# Altium project battery_expansion_breakout.PrjPcb
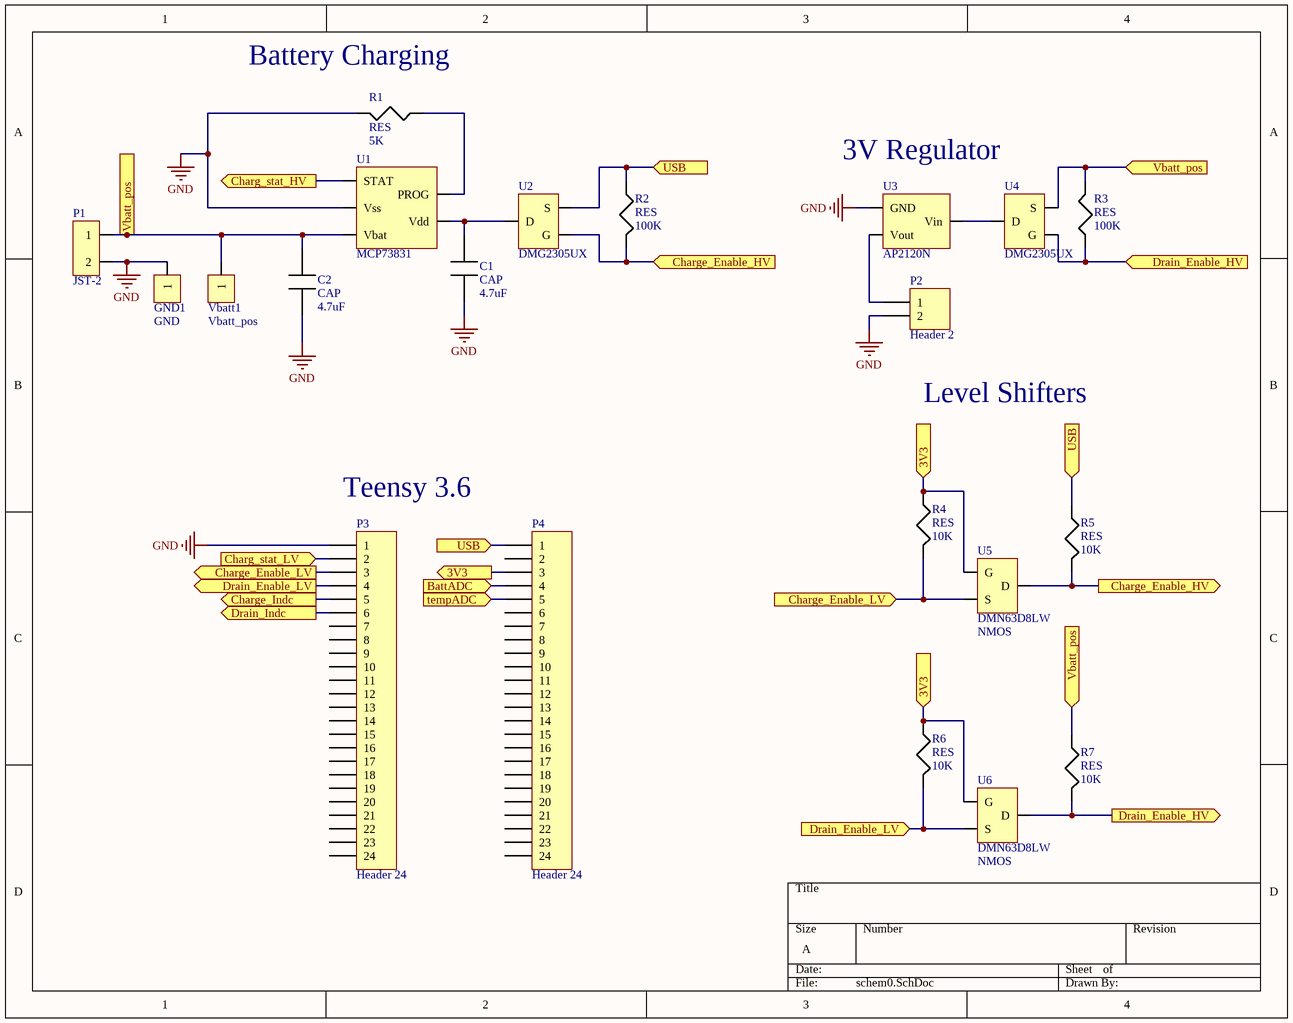
[diagram p0: schem0.SchDoc]
2 sheets, 32 parts. Net scope: flat (ports and power ports of the same name join across sheets).
Board file: pcb.PcbDoc
Sheets:
  schem0.SchDoc
  schem1.SchDoc

## Sheet schem0.SchDoc
size A

### Parts
C1  CAP  value 4.7uF  [Cap 0603 (1608 metric)]
C2  CAP  value 4.7uF  [Cap 0603 (1608 metric)]
GND1  GND  [test pad]
P1  JST-2  [JST-2 SMT]
P2  Header 2  [HDR1X2]
P3  Header 24  [HDR1X24]
P4  Header 24  [HDR1X24]
R1  RES  value 5K  [Res 0603 (1608 metric)]
R2  RES  value 100K  [Res 0603 (1608 metric)]
R3  RES  value 100K  [Res 0603 (1608 metric)]
R4  RES  value 10K  [Res 0603 (1608 metric)]
R5  RES  value 10K  [Res 0603 (1608 metric)]
R6  RES  value 10K  [Res 0603 (1608 metric)]
R7  RES  value 10K  [Res 0603 (1608 metric)]
U1  MCP73831  [SOT23127P600-8N]
U2  DMG2305UX  [SOT105P240X110-3N]
U3  AP2120N  [AP2120]
U4  DMG2305UX  [SOT105P240X110-3N]
U5  DMN63D8LW  [DMN63D8LW]
U6  DMN63D8LW  [DMN63D8LW]
Vbatt1  Vbatt_pos  [test pad]

### Ports
3V3 (in), 3V3 (out), BattADC (in), Charg_stat_HV (out), Charg_stat_LV (in), Charge_Enable_HV (in), Charge_Enable_HV (out), Charge_Enable_LV (in), Charge_Enable_LV (out), Charge_Indc (out), Drain_Enable_HV (in), Drain_Enable_HV (out), Drain_Enable_LV (in), Drain_Enable_LV (out), Drain_Indc (out), tempADC (in), USB (in), Vbatt_pos (in), Vbatt_pos (out)

### Nets
GND: C1.1 C2.1 GND1.1 P1.2 P2.2 P3.1 R1.2 U1.2(Vss) U3.1(GND)
NetC1_2: C1.2 U1.4(Vdd) U2.3(D)
NetC2_2: C2.2 P1.1 R3.2 R7.1 U1.3(Vbat) U4.2(S) Vbatt1.1 ; port Vbatt_pos
NetC3_2: P4.3 R4.1 R6.1 U5.1(G) U6.1(G) ; port 3V3
NetD1_1: P3.5 ; port Charge_Indc
NetD2_1: P3.6 ; port Drain_Indc
NetP2_1: P2.1 U3.2(Vout)
NetP3_2: P3.2 ; port Charg_stat_LV
NetP3_3: P3.3 R4.2 U5.2(S) ; port Charge_Enable_LV
NetP3_4: P3.4 R6.2 U6.2(S) ; port Drain_Enable_LV
NetP4_1: P4.1 R2.1 R5.1 U2.2(S) ; port USB
NetP4_4: P4.4 ; port BattADC
NetP4_5: P4.5 ; port tempADC
NetR1_1: R1.1 U1.5(PROG)
NetR2_2: R2.2 R5.2 U2.1(G) U5.3(D) ; port Charge_Enable_HV
NetR3_1: R3.1 R7.2 U4.1(G) U6.3(D) ; port Drain_Enable_HV
NetR12_1: U1.1(STAT) ; port Charg_stat_HV
NetU3_3: U3.3(Vin) U4.3(D)

Not connected (* = marked no-connect by the designer): P3 7 8 9 10 11 12 13 14 15 16 17 18 19 20 21 22 23 24; P4 2 6 7 8 9 10 11 12 13 14 15 16 17 18 19 20 21 22 23 24

### Notes on the sheet
- (near R1) Battery Charging
- 3V Regulator
- Level Shifters
- Teensy 3.6
- (in symbol DMN63D8LW) NMOS

### Library data of the parts
GND1 Vbatt1 = test_pad: test pad
P2 = Header 2: Header, 2-Pin; LatestRevisionDate: 17-Jul-2002; LatestRevisionNote: Re-released for DXP Platform.; Publisher: Altium Limited
P3 P4 = Header 24: Header, 24-Pin; LatestRevisionDate: 17-Jul-2002; LatestRevisionNote: Re-released for DXP Platform.; Publisher: Altium Limited
U1 = MCP73831: Li-Charge Management Controllers
U2 U4 = DMG2305UX: P-MOSFET
U3 = AP2120N: 3.0V regulator
U5 U6 = DMN63D8LW: N-MOSFET SOT-323

## Sheet schem1.SchDoc
size A
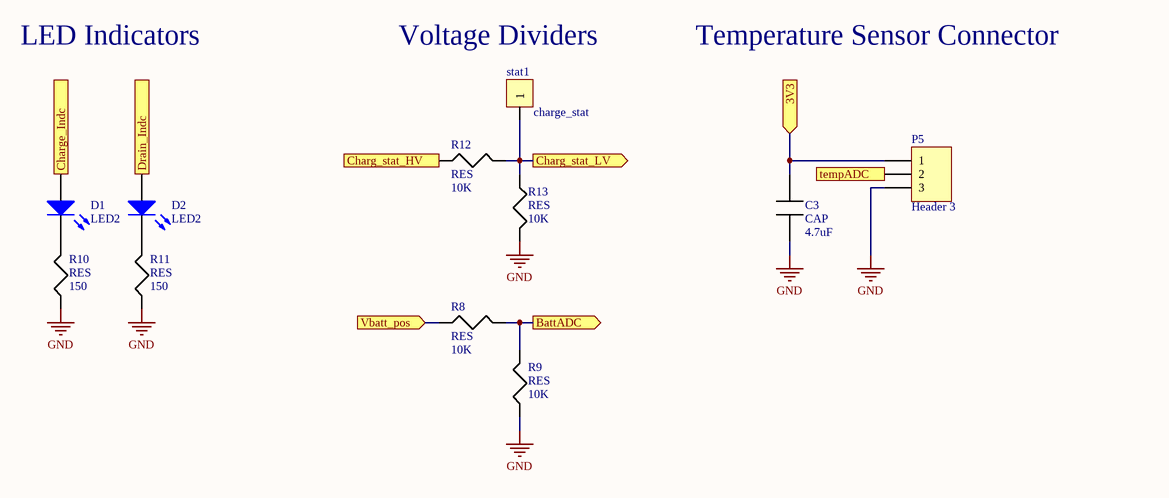
[diagram p1: schem1.SchDoc]

### Parts
C3  CAP  value 4.7uF  [Cap 0603 (1608 metric)]
D1  LED2  [3.2X1.6X1.1]
D2  LED2  [3.2X1.6X1.1]
P5  Header 3  [HDR1X3]
R8  RES  value 10K  [Res 0603 (1608 metric)]
R9  RES  value 10K  [Res 0603 (1608 metric)]
R10  RES  value 150  [Res 0603 (1608 metric)]
R11  RES  value 150  [Res 0603 (1608 metric)]
R12  RES  value 10K  [Res 0603 (1608 metric)]
R13  RES  value 10K  [Res 0603 (1608 metric)]
stat1  charge_stat  [test pad]

### Ports
3V3 (in), BattADC (out), Charg_stat_HV (in), Charg_stat_LV (out), Charge_Indc (in), Drain_Indc (in), tempADC (in), Vbatt_pos (in)

### Nets
GND: C3.1 P5.3 R9.1 R10.1 R11.1 R13.2
NetC2_2: R8.1 ; port Vbatt_pos
NetC3_2: C3.2 P5.1 ; port 3V3
NetD1_1: D1.1(A) ; port Charge_Indc
NetD1_2: D1.2(K) R10.2
NetD2_1: D2.1(A) ; port Drain_Indc
NetD2_2: D2.2(K) R11.2
NetP3_2: R12.2 R13.1 stat1.1 ; port Charg_stat_LV
NetP4_4: R8.2 R9.2 ; port BattADC
NetP4_5: P5.2 ; port tempADC
NetR12_1: R12.1 ; port Charg_stat_HV

### Notes on the sheet
- LED Indicators
- Voltage Dividers
- Temperature Sensor Connector

### Library data of the parts
D1 D2 = LED2: Typical RED, GREEN, YELLOW, AMBER GaAs LED; Published: 8-Jun-2000; LatestRevisionDate: 17-Jul-2002; LatestRevisionNote: Re-released for DXP Platform.; PackageVersion: Feb-2002; PackageReference: 3.2X1.6X1.1; Publisher: Altium Limited; PackageDescription: SM LED; 2 Flat Leads
P5 = Header 3: Header, 3-Pin; LatestRevisionDate: 17-Jul-2002; LatestRevisionNote: Re-released for DXP Platform.; Publisher: Altium Limited
stat1 = test_pad: test pad

## Nets that join several sheets
GND: schem0 (9 pins), schem1 (6 pins)
NetC2_2: schem0 (7 pins), schem1 (R8.1)
NetC3_2: schem0 (5 pins), schem1 (C3.2 P5.1)
NetD1_1: schem0 (P3.5), schem1 (D1.1)
NetD2_1: schem0 (P3.6), schem1 (D2.1)
NetP3_2: schem0 (P3.2), schem1 (R12.2 R13.1 stat1.1)
NetP4_4: schem0 (P4.4), schem1 (R8.2 R9.2)
NetP4_5: schem0 (P4.5), schem1 (P5.2)
NetR12_1: schem0 (U1.1), schem1 (R12.1)